# Altium schematic sheet IN_OUT.SchDoc: StrayCAT - IN_OUT
size A4; Organization: Cyrola Incorporated; Address1: WeWork Namba SkyO; Address2: 27th Floor, Namba 5-1-60; Address3: Chuo-ku, Osaka; Address4: 542-0076, JAPAN; DocumentNumber: CR22-1128; Revision: 1; SheetNumber: 2; SheetTotal: 2; PageSetup: Record=PageOptions|CenterHorizontal=True|CenterVertical=True|PrintScale=1.00|XCorrection=1.00|YCorrection=1.00|PrintKind=0|BorderSize=5000000|LeftOffset=0|BottomOffset=0|Orientation=2|PaperLength=1000|PaperWidth=1000|Scale=100|PaperSource=7|PrintQuality=-3|MediaType=1|DitherType=10|PrintScaleMode=1|PaperKind=A4|PaperIndex=9
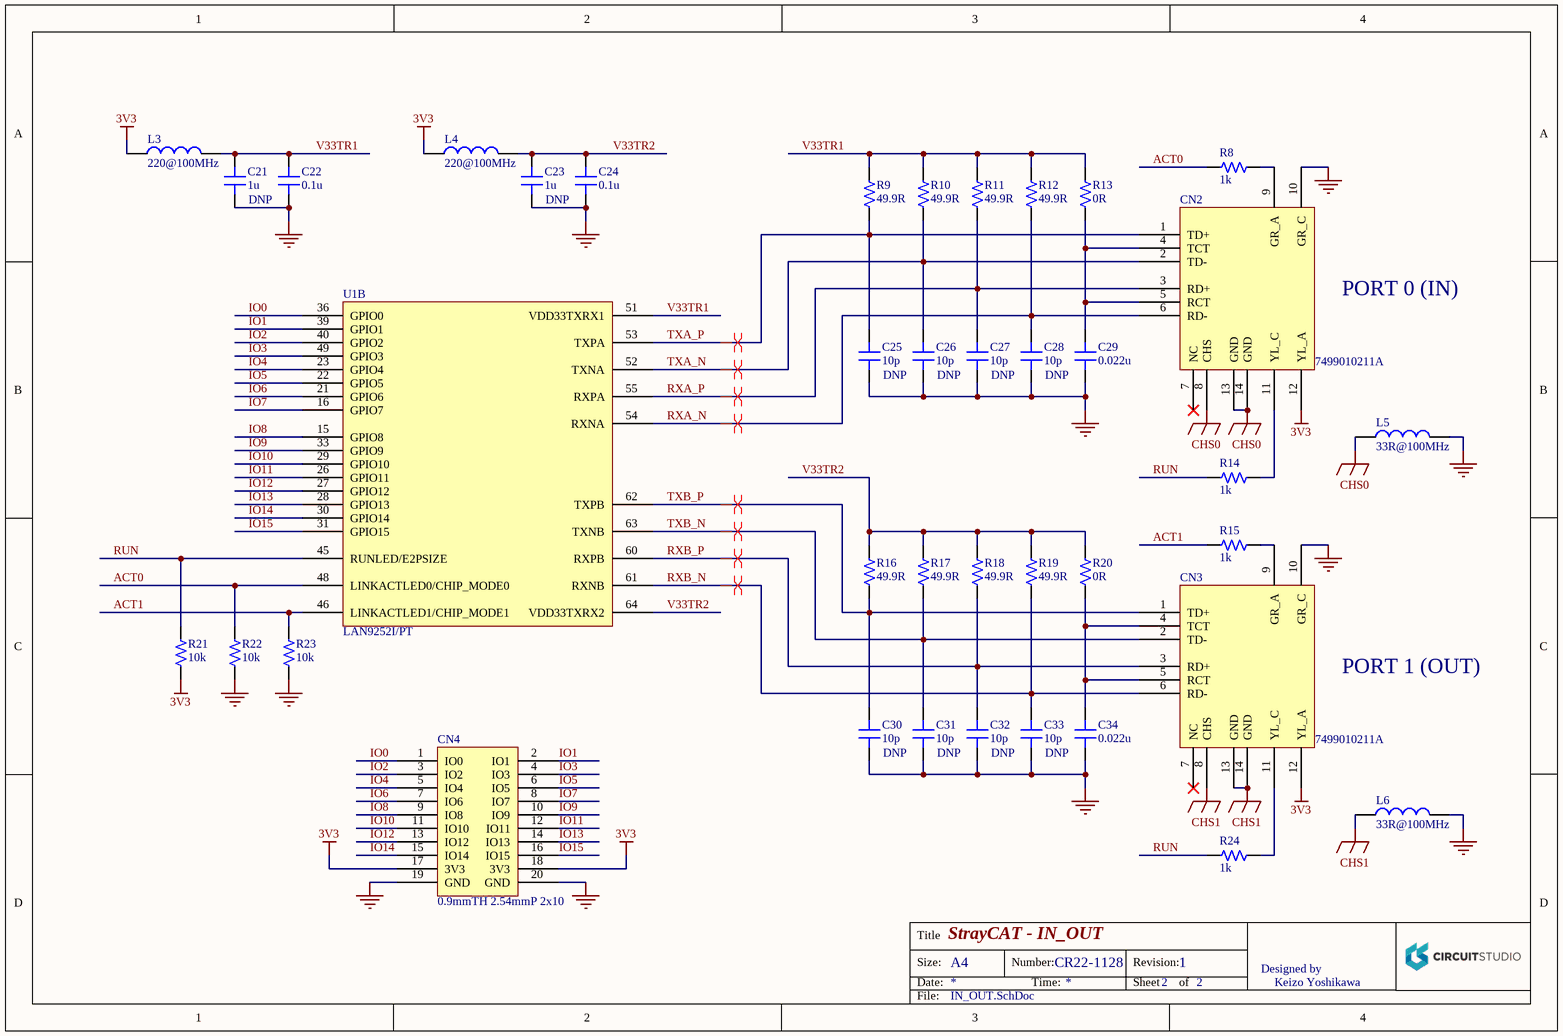
[diagram p0: IN_OUT.SchDoc]

## Parts
C21  1u  [CGA3]
C22  0.1u  [CGA3]
C23  1u  [CGA3]
C24  0.1u  [CGA3]
C25  10p  [CGA3]
C26  10p  [CGA3]
C27  10p  [CGA3]
C28  10p  [CGA3]
C29  0.022u  [CGA3]
C30  10p  [CGA3]
C31  10p  [CGA3]
C32  10p  [CGA3]
C33  10p  [CGA3]
C34  0.022u  [CGA3]
CN2  7499010211A  [7499010211A]
CN3  7499010211A  [7499010211A]
CN4  0.9mmTH 2.54mmP 2x10  [61302021121]
L3  220@100MHz  [BLM18EG221SN1D]
L4  220@100MHz  [BLM18EG221SN1D]
L5  33R@100MHz  [BLM18PG330SN1D]
L6  33R@100MHz  [BLM18PG330SN1D]
R8  1k  [RK73x1J]
R9  49.9R  [RK73x1J]
R10  49.9R  [RK73x1J]
R11  49.9R  [RK73x1J]
R12  49.9R  [RK73x1J]
R13  0R  [RK73x1J]
R14  1k  [RK73x1J]
R15  1k  [RK73x1J]
R16  49.9R  [RK73x1J]
R17  49.9R  [RK73x1J]
R18  49.9R  [RK73x1J]
R19  49.9R  [RK73x1J]
R20  0R  [RK73x1J]
R21  10k  [RK73x1J]
R22  10k  [RK73x1J]
R23  10k  [RK73x1J]
R24  1k  [RK73x1J]
U1  LAN9252I/PT  [TSQFP50P1200X1200X105_HS-65N]  (part B of 2)

## Nets
3V3: CN2.12(YL_A) CN3.12(YL_A) CN4.17(3V3) CN4.18(3V3) L3.1 L4.1 R21.2
CHS0: CN2.8(CHS) CN2.13(GND) CN2.14(GND) L5.1
CHS1: CN3.8(CHS) CN3.13(GND) CN3.14(GND) L6.1
GND: C21.2 C22.2 C23.2 C24.2 C25.2 C26.2 C27.2 C28.2 C29.2 C30.2 C31.2 C32.2 C33.2 C34.2 CN2.10(GR_C) CN3.10(GR_C) CN4.19(GND) CN4.20(GND) L5.2 L6.2 R22.2 R23.2
ACT0: R8.1 R22.1 U1.48(LINKACTLED0/CHIP_MODE0)
ACT1: R15.1 R23.1 U1.46(LINKACTLED1/CHIP_MODE1)
IO0: CN4.1(IO0) U1.36(GPIO0)
IO1: CN4.2(IO1) U1.39(GPIO1)
IO2: CN4.3(IO2) U1.40(GPIO2)
IO3: CN4.4(IO3) U1.49(GPIO3)
IO4: CN4.5(IO4) U1.23(GPIO4)
IO5: CN4.6(IO5) U1.22(GPIO5)
IO6: CN4.7(IO6) U1.21(GPIO6)
IO7: CN4.8(IO7) U1.16(GPIO7)
IO8: CN4.9(IO8) U1.15(GPIO8)
IO9: CN4.10(IO9) U1.33(GPIO9)
IO10: CN4.11(IO10) U1.29(GPIO10)
IO11: CN4.12(IO11) U1.26(GPIO11)
IO12: CN4.13(IO12) U1.27(GPIO12)
IO13: CN4.14(IO13) U1.28(GPIO13)
IO14: CN4.15(IO14) U1.30(GPIO14)
IO15: CN4.16(IO15) U1.31(GPIO15)
RUN: R14.1 R21.1 R24.1 U1.45(RUNLED/E2PSIZE)
RXA_N: C28.1 CN2.6(RD-) R12.2 U1.54(RXNA)
RXA_P: C27.1 CN2.3(RD+) R11.2 U1.55(RXPA)
RXB_N: C33.1 CN3.6(RD-) R19.2 U1.61(RXNB)
RXB_P: C32.1 CN3.3(RD+) R18.2 U1.60(RXPB)
TXA_N: C26.1 CN2.2(TD-) R10.2 U1.52(TXNA)
TXA_P: C25.1 CN2.1(TD+) R9.2 U1.53(TXPA)
TXB_N: C31.1 CN3.2(TD-) R17.2 U1.63(TXNB)
TXB_P: C30.1 CN3.1(TD+) R16.2 U1.62(TXPB)
V33TR1: C21.1 C22.1 L3.2 R9.1 R10.1 R11.1 R12.1 R13.1 U1.51(VDD33TXRX1)
V33TR2: C23.1 C24.1 L4.2 R16.1 R17.1 R18.1 R19.1 R20.1 U1.64(VDD33TXRX2)
NetC29_1: C29.1 CN2.4(TCT) CN2.5(RCT) R13.2
NetC34_1: C34.1 CN3.4(TCT) CN3.5(RCT) R20.2
NetCN2_9: CN2.9(GR_A) R8.2
NetCN2_11: CN2.11(YL_C) R14.2
NetCN3_9: CN3.9(GR_A) R15.2
NetCN3_11: CN3.11(YL_C) R24.2

Not connected (* = marked no-connect by the designer): CN2 7(NC)*; CN3 7(NC)*

## Layout directives
differential pair; differential pair class DIFFPAIR_LAN; net class DIFFPAIR: RXA_N, RXA_P, RXB_N, RXB_P, TXA_N, TXA_P, TXB_N, TXB_P

## Notes on the sheet
- DNP
- (near CN2) PORT 0 (IN)
- (near CN3) PORT 1 (OUT)
- Title
- Size:
- Date:
- A4
- Number:
- Time:
- Revision:
- Sheet
- of
- Designed by
- Keizo Yoshikawa
- File:

## Library data of the parts
C21 C23 = CGA3E1X7R1E105K080AC: 1608 1uF 25V X7R 10%
C22 C24 = CGA3E2X7R1H104K080AA: 1608 0.1uF 50V X7R 10%
C25-C28 C30-C33 = CGA3E2C0G1H100D080AA: 1608 10pF 50V C0G 5%
C29 C34 = CGA3E2X7R1H223K080AA: 1608 0.022uF 50V X7R 10%
CN2 CN3 = 7499010211A: WE-RJ45LAN 10/100 Base-T
CN4 = 61302021121: WR-PHD Pin Header 20pin
L3 L4 = BLM18EG221SN1D: Noise Suppression Chip Ferrite Bead
L5 L6 = BLM18PG330SN1D: Noise Suppression Chip Ferrite Bead
R8 R14 R15 R24 = RK73B1JTTD102J: 1608 1kOhm 5% 1/8W
R9-R12 R16-R19 = RK73H1JTTD49R9F: 1608 49.9Ohm 1% 1/8W
R13 R20 = RK73Z1JTTD: 1608 0-Ohm 1A
R21-R23 = RK73B1JTTD103J: 1608 10kOhm 5% 1/10W
U1 = LAN9252I_PT: EtherCAT Slave Controller